# EAGLE design M8-Thermocouple (EAGLE 9.5.2)
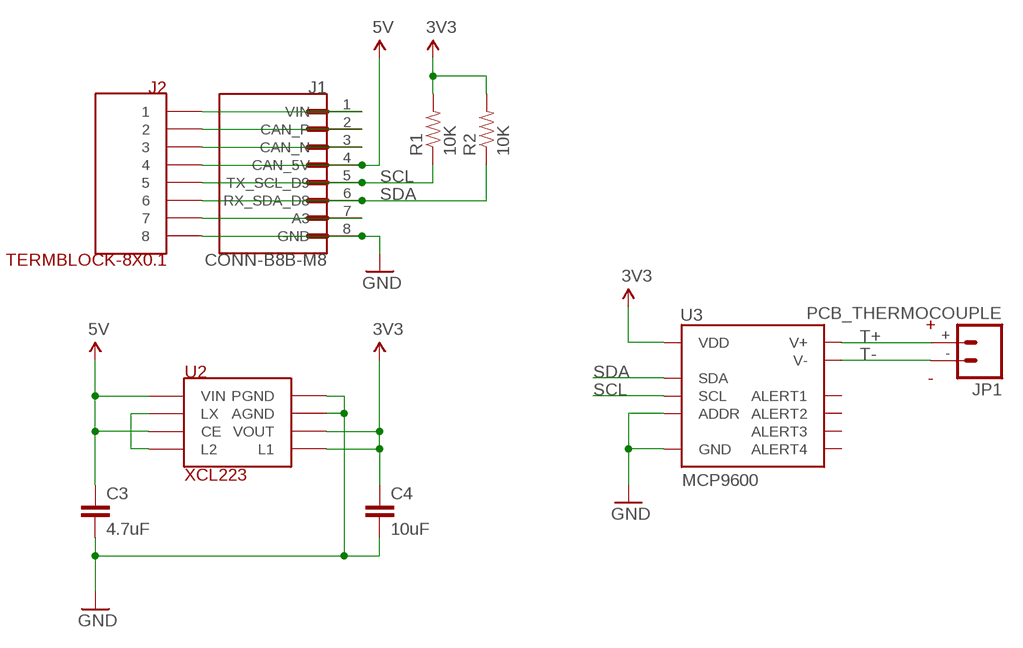
[diagram p0: schematic, sheet 1]

## Parts
C3  4.7uF  CAP-4.7UF-0603  [0603-CAP]
C4  10uF  CAP-10UF-0603  [0603-CAP]
J1  CONN-B8B-M8  [JST_B8B-PH-SM4-TB(LF)(SN)]
J2  TERMBLOCK-8X0.1  [TERMBLOCK-8X0.1]
JP1  PCB_THERMOCOUPLE  [PCC-SMP]
R1  10K  RES-10K-06030603  [0603-RES]
R2  10K  RES-10K-06030603  [0603-RES]
U2  XCL223  REG-XCL223  [REG-XCL223-LESS-CREAM]
U3  MCP9600  MCP9600-SMD  [MQFN-20]

## Nets
3V3: C4.1 R1.2 R2.2 U2.3(VOUT) U2.7(L1) U3.8(VDD)
5V: C3.1 J1.4(CAN_5V) J2.P$4 U2.4(CE) U2.6(VIN)
A3: J1.7(A3) J2.P$7
CAN_N: J1.3(CAN_N) J2.P$3
CAN_P: J1.2(CAN_P) J2.P$2
GND: C3.2 C4.2 J1.8(GND) J2.P$8 U2.1(PGND) U2.2(AGND) U3.1(GND) U3.3(GND) U3.5(GND) U3.6(GND) U3.7(GND) U3.9(GND) U3.10(GND) U3.13(GND) U3.16(ADDR) U3.17(GND) U3.18(GND) U3.21(GND)
LX: U2.5(LX) U2.8(L2)
SCL: J1.5(TX_SCL_D9) J2.P$5 R1.1 U3.19(SCL)
SDA: J1.6(RX_SDA_D8) J2.P$6 R2.1 U3.20(SDA)
T+: JP1.+ U3.2(V+)
T-: JP1.- U3.4(V-)
VIN: J1.1(VIN) J2.P$1
Unconnected: JP1.CLIP1 JP1.CLIP2 U3.11(ALERT1) U3.12(ALERT2) U3.14(ALERT3) U3.15(ALERT4)

## Library data of the parts
C3 = rickk2:CAP-4.7UF-0603: Murata X5R series CAP CER 4.7UF 6.3V X5R 0603 $0.12 https://www.digikey.com/product-detail/en/murata-electronics-north-america/GRM188R60J475KE19J/490-6407-1-ND/3845604
C4 = rickk2:CAP-10UF-0603: CAP CER 10UF 16V X5R 0805 $ 0.21 https://www.digikey.com/product-detail/en/murata-electronics-north-america/GRM21BR61C106KE15L/490-3886-1-ND/965928
J1 = rickk2:CONN-B8B-M8: PH Series 2 mm Pitch 12 Position SMT Single Row Top Entry Shrouded Header
J2 = rickk2:TERMBLOCK-8X0.1: Term Block 8x0.1" 20-30AWG 6A 125V Max Side Entry On Shore Technology Inc. OSTVN08A150 TERM BLK 8P SIDE ENT 2.54MM PCB 8 Position Wire to Board Terminal Block Horizontal with Board 0.100" (2.54mm) Through Hole https://www.digikey.com/product-detail/en/on-shore-technology-inc/OSTVN08A150/ED10566-ND/1588868
JP1 = SparkFun-Electromechanical:PCB_THERMOCOUPLE: Circuit Board Thermocouple Connectors Glass-Filled Nylon 220°C (425°F) The PCC connector from OMEGA is perfect for bringing thermocouple probes to printed circuit boards. (OMEGA PCC-SMP) For type-k thermocouples.; PROD_ID: CONN-13075
R1 R2 = rickk2:RES-10K-0603: RES SMD 10K OHM 5% 1/4W 0603 $ 0.10 https://www.digikey.com/product-detail/en/panasonic-electronic-components/ERJ-PA3J103V/P10KBZCT-ND/5036237
U2 = rickk2:REG-XCL223: Manufacturer: Torex Semiconductor Ltd Manufacturer Part Number: XCL223A333D2-G DC DC CONVERTER 3.3V Detailed Description: Non-Isolated PoL Modul $2.63 https://www.digikey.com/product-detail/en/torex-semiconductor-ltd/XCL223A333D2-G/893-1416-1-ND/8256118 CIN=4.7uF 10V CL = 10uF 10V VIN MAX=5.5V VOUT=3.3V
U3 = rickk2:MCP9600: Thermocouple EMF to Temperature Converter; PROD_ID: IC-14644

## Board
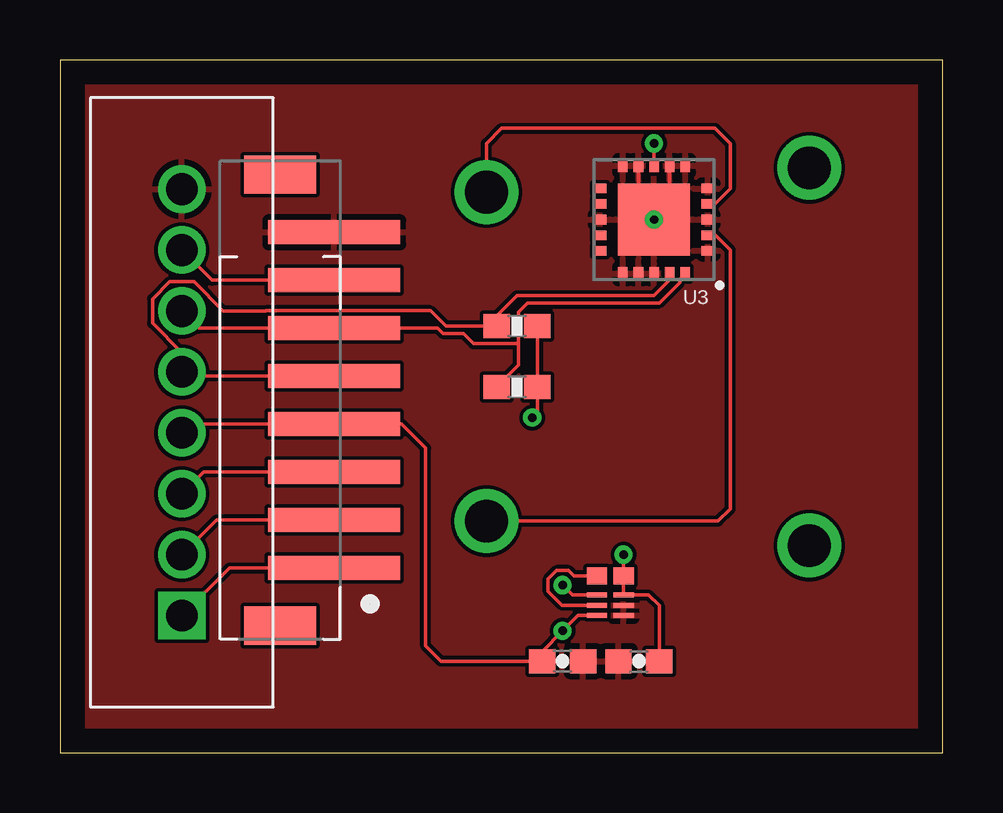
[diagram p1: board, top side]
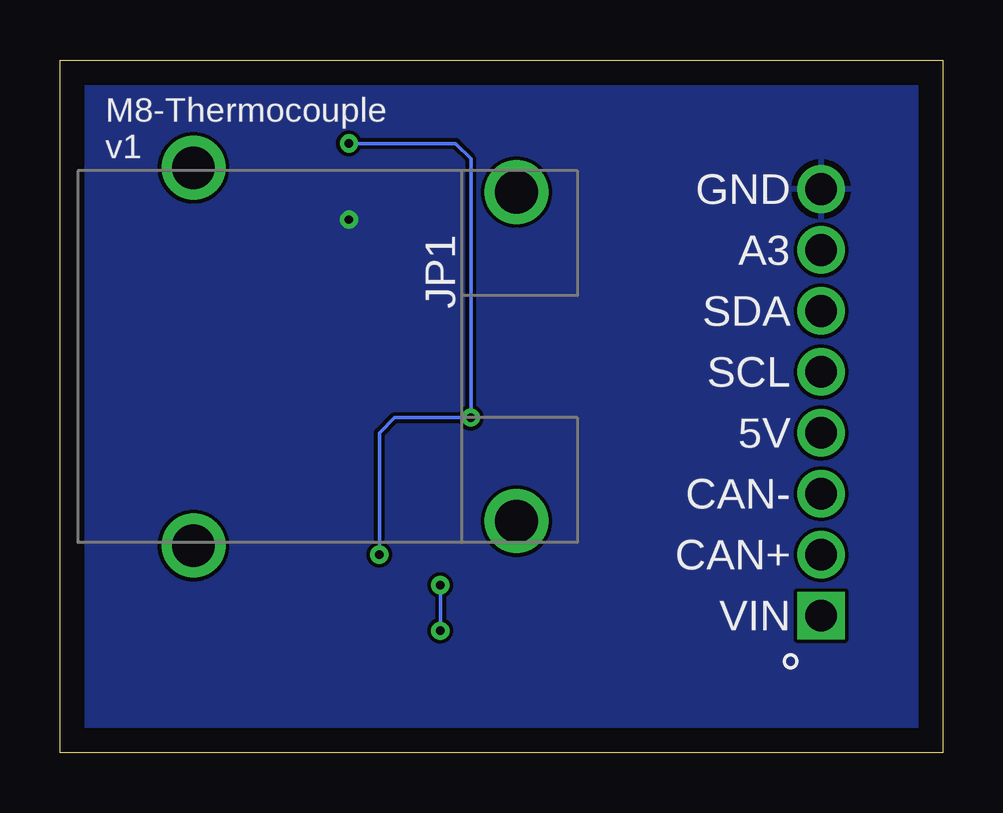
[diagram p2: board, bottom side, seen from below]

Size 36.81 x 28.88 mm. Coordinates in mm from the lower left corner, seen from the top.
Outline: 0,0 36.81,0 36.81,28.88 0,28.88 0,0
Copper layers (1*16): Top 0.035mm / dielectric 1.5mm / Bottom 0.035mm
Design rules "default": minimum track width 6mil, minimum drill 0.35mm, track to track 6mil, track to pad 6mil, pad to pad 6mil, via to via 6mil, smd to smd 6mil, copper to edge 40mil, drill to drill 6mil, minimum pad ring 10mil, minimum via ring 8mil, stop-mask expansion 4mil, vias tented up to drill 0mil, thermal gap 10mil

### Footprints (pad centres in the part's own frame; a part is rotated, then mirrored left to right if it is on the bottom)
0603-CAP = smd 1.1 x 1: 1 -0.85,0; 2 0.85,0
JST_B8B-PH-SM4-TB(LF)(SN) = smd 1 x 5.5: 1 -5,0; 2 -3,0; 3 -1,0; 4 1,0; 5 3,0; 6 5,0; 7 7,0; 8 9,0 | smd 1.6 x 3: P1 -7.4,2.25; P2 11.4,2.25
TERMBLOCK-8X0.1 = drill 1.321 square: P$1 -8.89,0 | drill 1.321: P$2 -6.35,0; P$3 -3.81,0; P$4 -1.27,0; P$5 1.27,0; P$6 3.81,0; P$7 6.35,0; P$8 8.89,0
PCC-SMP = drill 1.778: + 6.858,0; - -6.858,0; CLIP1 -7.874,-13.462; CLIP2 7.874,-13.462
0603-RES = smd 1.1 x 1: 1 -0.85,0; 2 0.85,0
REG-XCL223-LESS-CREAM = smd 0.85 x 0.21: 1 0,0; 2 0,0.43; 3 0,0.86; 4 -1.11,0.86; 5 -1.11,0.43; 6 -1.11,0 | smd 0.85 x 0.7: 7 0,1.655; 8 -1.11,1.655
MQFN-20 = smd 0.55 x 0.4: 1 -2.25,1.3; 2 -2.25,0.65; 3 -2.25,0; 4 -2.25,-0.65; 5 -2.25,-1.3; 11 2.25,-1.3; 12 2.25,-0.65; 13 2.25,0; 14 2.25,0.65; 15 2.25,1.3 | smd 0.4 x 0.55: 6 -1.3,-2.25; 7 -0.65,-2.25; 8 0,-2.25; 9 0.65,-2.25; 10 1.3,-2.25; 16 1.3,2.25; 17 0.65,2.25; 18 0,2.25; 19 -0.65,2.25; 20 -1.3,2.25 | smd 3 x 3: 21 0,0

### Placement (x,y rotation side)
C3  20.95,3.81 0 top
C4  24.13,3.81 180 top
J1  11.43,12.7 90 top
J2  5.08,14.61 90 top
JP1  17.78,16.51 270 bottom
R1  19.05,17.78 0 top
R2  19.05,15.24 0 top
U2  23.5,5.71 0 top
U3  24.77,22.23 180 top

### Tracks (layer width: path | path; a pad name or v marks a point on that pad's centre or on a via)
3V3  (via drill 0.35)
  Top 0.152: C4.1 24.98,6.13 24.54,6.58 U2.3 U2.7 v23.5,8.26 | R1.2 R2.2 19.9,14.19 v19.68,13.97 | U3.8 v24.77,25.4
  Bottom 0.152: v24.77,25.4 20.32,25.4 19.68,24.77 v19.68,13.97 22.86,13.97 23.5,13.34 v23.5,8.26
5V  (via drill 0.35)
  Top 0.152: U2.4 21.36,6.58 v20.95,6.99 | U2.6 21.59,5.71 v20.95,5.08 20.11,4.23 C3.1 15.88,3.81 15.24,4.45 15.24,12.7 14.24,13.7 J1.4 5.45,13.7 J2.P$4
  Bottom 0.152: v20.95,6.99 v20.95,5.08
A3
  Top 0.152: J1.7 6.33,19.7 J2.P$7
CAN_N
  Top 0.152: J1.3 5.99,11.7 J2.P$3
CAN_P
  Top 0.152: J1.2 6.53,9.7 J2.P$2
GND  (via drill 0.35)
  Top 0.152: U3.7 25.41,22.88 U3.21 24.11,22.88 U3.9
  other vias: 24.77,22.23
  pour Top: 0,0 0,30.48 39.37,30.48 39.37,0
  pour Bottom: 0,0 0,31.75 41.91,31.75 41.91,0
LX
  Top 0.152: U2.8 21.43,7.37 21.21,7.59 20.7,7.59 20.35,7.24 20.35,6.73 20.94,6.14 U2.5
SCL
  Top 0.152: J1.5 5.25,15.7 J2.P$5 5.08,16.69 3.86,17.91 3.86,18.92 4.58,19.63 5.58,19.63 6.8,18.41 8.57,18.41 8.59,18.43 15.44,18.43 16.09,17.78 R1.1 18.2,18.2 19.05,19.05 24.77,19.05 25.41,19.7 U3.19
SDA
  Top 0.152: J2.P$6 5.79,17.7 J1.6 15.24,17.7 15.74,17.7 15.96,17.48 16.82,17.48 17.24,17.05 19.03,17.05 19.12,17.14 | U3.20 25.84,19.75 25.84,19.61 24.98,18.75 19.49,18.75 19.12,18.38 19.12,17.14 | R2.1 19.12,16.16 19.12,17.14
T+
  Top 0.152: JP1.+ 27.43,9.65 27.94,10.16 27.94,20.95 27.32,21.57 U3.2
T-
  Top 0.152: U3.4 27.3,22.88 27.94,23.51 27.94,25.4 27.3,26.04 18.41,26.04 17.78,25.4 JP1.-
VIN
  Top 0.152: J2.P$1 7.07,7.7 J1.1

### Text on the board
bPlace: M8-Thermocouple / v1 | GND | A3 | SDA | SCL | 5V | CAN- | CAN+ | VIN